# EAGLE design Attenuator (EAGLE 9.3.1)
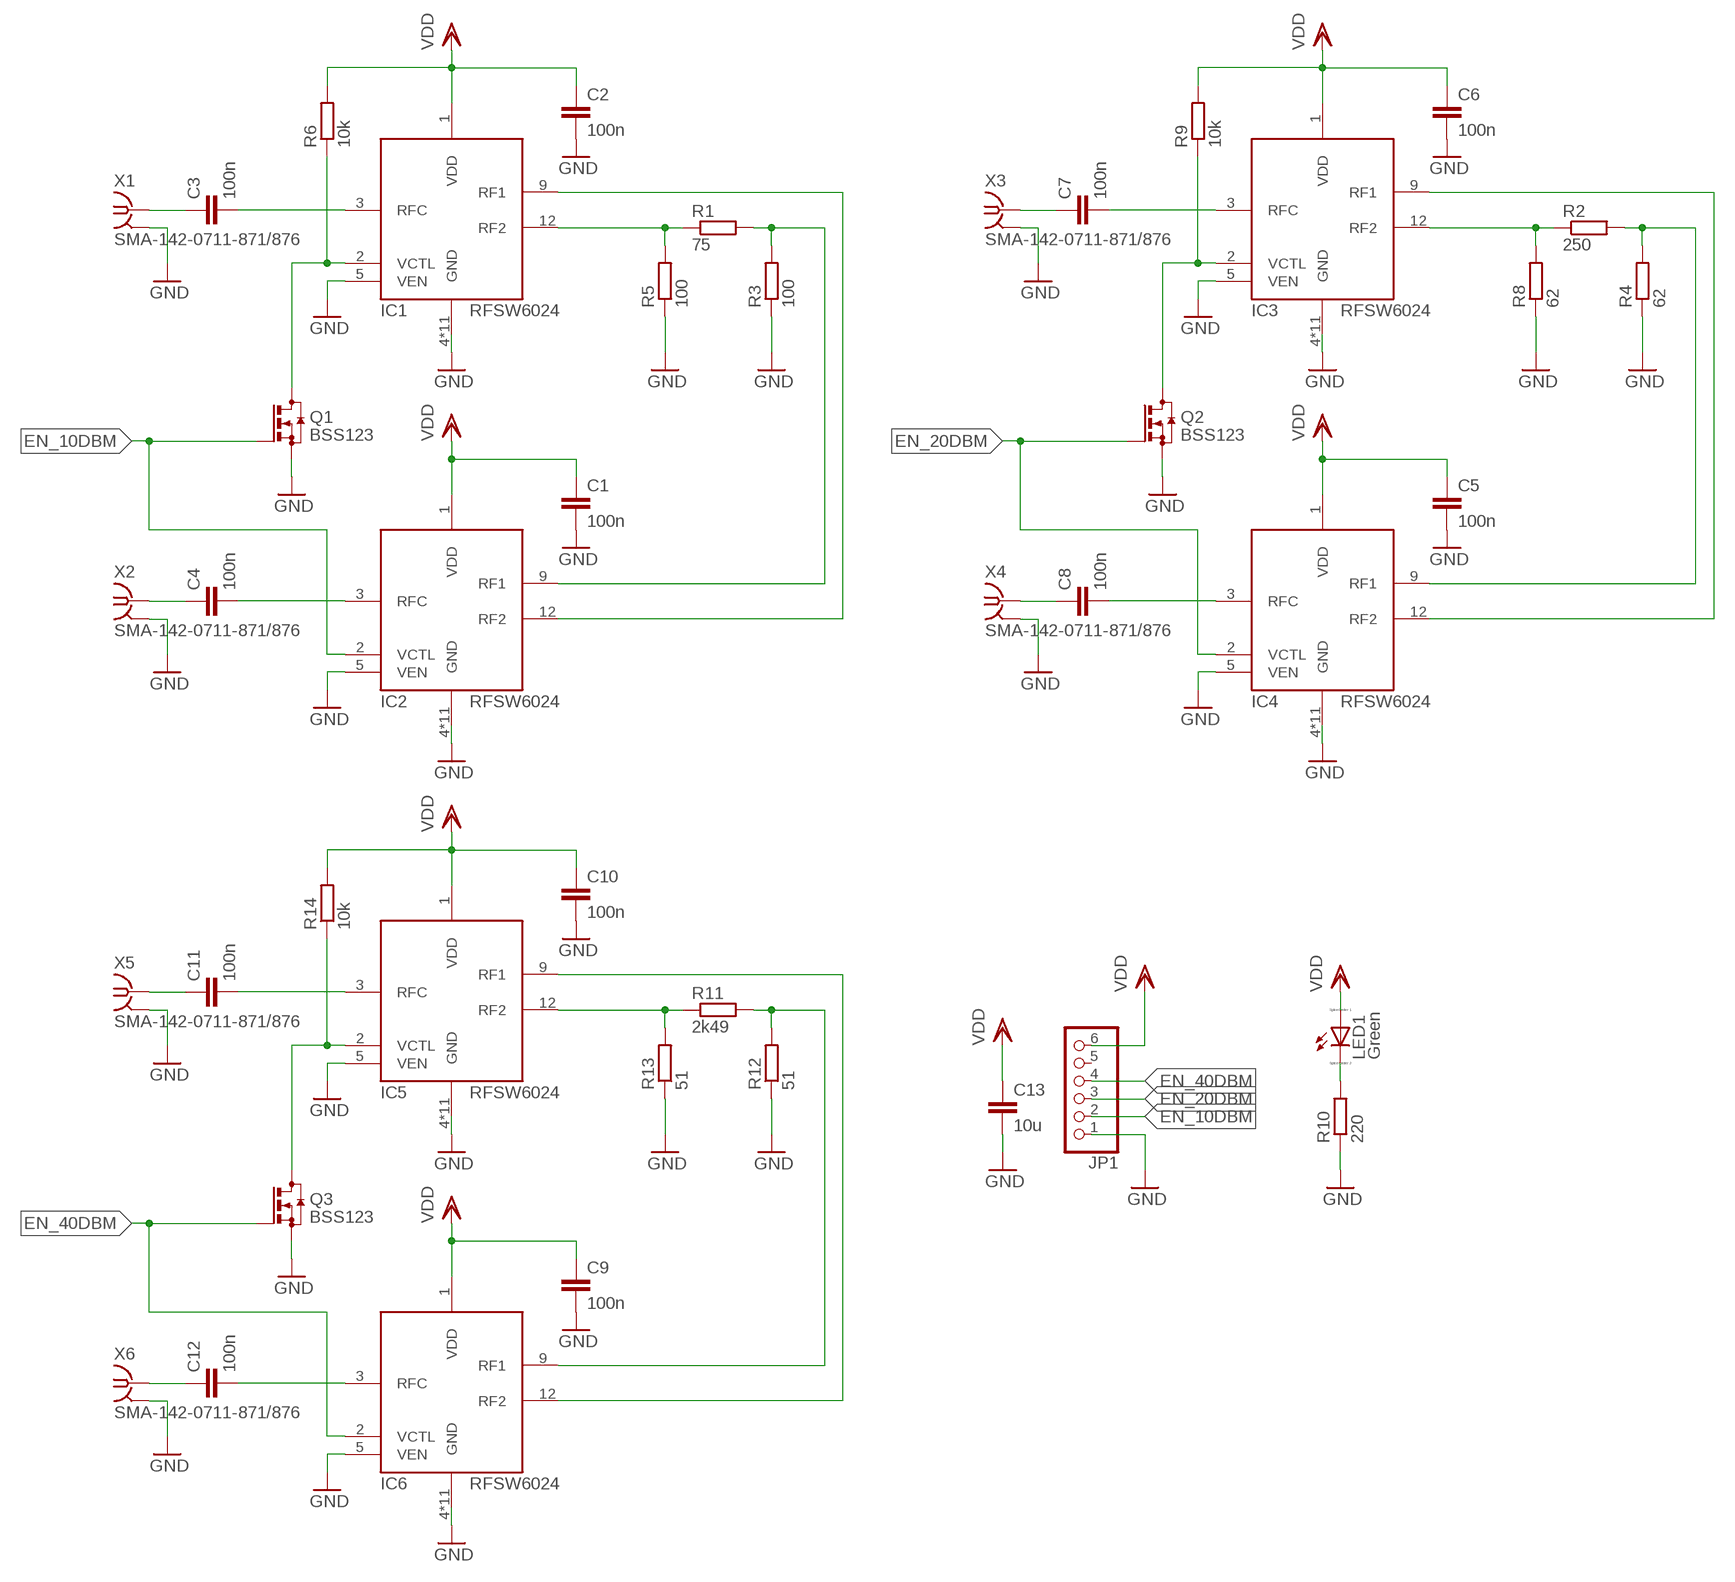
[diagram p0: schematic, sheet 1]

## Parts
C1  100n  C-EUC0603K  [C0603K]
C2  100n  C-EUC0603K  [C0603K]
C3  100n  C-EUC0603K  [C0603K]
C4  100n  C-EUC0603K  [C0603K]
C5  100n  C-EUC0603K  [C0603K]
C6  100n  C-EUC0603K  [C0603K]
C7  100n  C-EUC0603K  [C0603K]
C8  100n  C-EUC0603K  [C0603K]
C9  100n  C-EUC0603K  [C0603K]
C10  100n  C-EUC0603K  [C0603K]
C11  100n  C-EUC0603K  [C0603K]
C12  100n  C-EUC0603K  [C0603K]
C13  10u  C-EUC1206  [C1206]
IC1  RFSW6024  [QFN16]
IC2  RFSW6024  [QFN16]
IC3  RFSW6024  [QFN16]
IC4  RFSW6024  [QFN16]
IC5  RFSW6024  [QFN16]
IC6  RFSW6024  [QFN16]
JP1  PINHD-1X6/90  [1X06/90]
LED1  Green  LED_ESML0603  [LED_SML0603]
Q1  BSS123  [SOT23]
Q2  BSS123  [SOT23]
Q3  BSS123  [SOT23]
R1  75  R-EU_R0603  [R0603]
R2  250  R-EU_R0603  [R0603]
R3  100  R-EU_R0603  [R0603]
R4  62  R-EU_R0603  [R0603]
R5  100  R-EU_R0603  [R0603]
R6  10k  R-EU_R0603  [R0603]
R8  62  R-EU_R0603  [R0603]
R9  10k  R-EU_R0603  [R0603]
R10  220  R-EU_R0603  [R0603]
R11  2k49  R-EU_R0603  [R0603]
R12  51  R-EU_R0603  [R0603]
R13  51  R-EU_R0603  [R0603]
R14  10k  R-EU_R0603  [R0603]
X1  SMA-142-0711-871/876  [J502-ND-142-0711-871/876]
X2  SMA-142-0711-871/876  [J502-ND-142-0711-871/876]
X3  SMA-142-0711-871/876  [J502-ND-142-0711-871/876]
X4  SMA-142-0711-871/876  [J502-ND-142-0711-871/876]
X5  SMA-142-0711-871/876  [J502-ND-142-0711-871/876]
X6  SMA-142-0711-871/876  [J502-ND-142-0711-871/876]

## Nets
EN_10DBM: IC2.2(VCTL) JP1.2 Q1.1(G)
EN_20DBM: IC4.2(VCTL) JP1.3 Q2.1(G)
EN_40DBM: IC6.2(VCTL) JP1.4 Q3.1(G)
GND: C1.2 C2.2 C5.2 C6.2 C9.2 C10.2 C13.2 IC1.4(GND) IC1.5(VEN) IC1.6(GND) IC1.7(GND) IC1.8(GND) IC1.10(GND) IC1.11(GND) IC1.13(GND) IC1.14(GND) IC1.15(GND) IC1.16(GND) IC1.17(GND) IC2.4(GND) IC2.5(VEN) IC2.6(GND) IC2.7(GND) IC2.8(GND) IC2.10(GND) IC2.11(GND) IC2.13(GND) IC2.14(GND) IC2.15(GND) IC2.16(GND) IC2.17(GND) IC3.4(GND) IC3.5(VEN) IC3.6(GND) IC3.7(GND) IC3.8(GND) IC3.10(GND) IC3.11(GND) IC3.13(GND) IC3.14(GND) IC3.15(GND) IC3.16(GND) IC3.17(GND) IC4.4(GND) IC4.5(VEN) IC4.6(GND) IC4.7(GND) IC4.8(GND) IC4.10(GND) IC4.11(GND) IC4.13(GND) IC4.14(GND) IC4.15(GND) IC4.16(GND) IC4.17(GND) IC5.4(GND) IC5.5(VEN) IC5.6(GND) IC5.7(GND) IC5.8(GND) IC5.10(GND) IC5.11(GND) IC5.13(GND) IC5.14(GND) IC5.15(GND) IC5.16(GND) IC5.17(GND) IC6.4(GND) IC6.5(VEN) IC6.6(GND) IC6.7(GND) IC6.8(GND) IC6.10(GND) IC6.11(GND) IC6.13(GND) IC6.14(GND) IC6.15(GND) IC6.16(GND) IC6.17(GND) JP1.1 Q1.2(S) Q2.2(S) Q3.2(S) R3.1 R4.1 R5.1 R8.1 R10.1 R12.1 R13.1 X1.G@1 X1.G@2 X1.G@3 X1.G@4 X2.G@1 X2.G@2 X2.G@3 X2.G@4 X3.G@1 X3.G@2 X3.G@3 X3.G@4 X4.G@1 X4.G@2 X4.G@3 X4.G@4 X5.G@1 X5.G@2 X5.G@3 X5.G@4 X6.G@1 X6.G@2 X6.G@3 X6.G@4
N$1: IC1.9(RF1) IC2.12(RF2)
N$2: IC1.12(RF2) R1.1 R5.2
N$3: IC2.9(RF1) R1.2 R3.2
N$4: IC3.12(RF2) R2.1 R8.2
N$5: C3.2 IC1.3(RFC)
N$6: C4.2 IC2.3(RFC)
N$7: C4.1 X2.1
N$8: C3.1 X1.1
N$9: IC1.2(VCTL) Q1.3(D) R6.1
N$11: IC4.9(RF1) R2.2 R4.2
N$12: IC3.9(RF1) IC4.12(RF2)
N$13: C7.2 IC3.3(RFC)
N$14: C8.2 IC4.3(RFC)
N$15: C8.1 X4.1
N$16: C7.1 X3.1
N$17: IC3.2(VCTL) Q2.3(D) R9.1
N$19: IC5.12(RF2) R11.1 R13.2
N$20: IC6.9(RF1) R11.2 R12.2
N$21: IC5.9(RF1) IC6.12(RF2)
N$22: C11.2 IC5.3(RFC)
N$23: C12.2 IC6.3(RFC)
N$24: C12.1 X6.1
N$25: C11.1 X5.1
N$26: IC5.2(VCTL) Q3.3(D) R14.1
N$29: LED1.C R10.2
VDD: C1.1 C2.1 C5.1 C6.1 C9.1 C10.1 C13.1 IC1.1(VDD) IC2.1(VDD) IC3.1(VDD) IC4.1(VDD) IC5.1(VDD) IC6.1(VDD) JP1.6 LED1.A R6.2 R9.2 R14.2
Unconnected: JP1.5

## Library data of the parts
C1-C12 = rcl:C-EU: CAPACITOR, European symbol; SPICEPREFIX: C
C13 = rcl:C-EU: CAPACITOR, European symbol
IC1-IC6 = custom-ic:RFSW6024
JP1 = pinhead:PINHD-1X6: PIN HEADER
LED1 = eagle-ltspice:LED_E: LED Source: http://www.osram.convergy.de Source: www.luxeon.com Source: www.kingbright.com; SPICEMODEL: NONE; SPICEPREFIX: D; SPICETYPE: diode
Q1-Q3 = transistor-small-signal:BSS123: N-CHANNEL MOS FET
R1-R6 R8-R14 = resistor:R-EU_: RESISTOR, European symbol
X1-X6 = con-coax:SMA-: SMA 50 Ohm End Launch Jack Receptacle - Round Contact Johnson Components Source: www.johnsoncomponents.com .. J502-ND.pdf; MF: JOHNSON COMPONENTS; MPN: 142-0711-871; OC_FARNELL: unknown; OC_NEWARK: 01C1639

## Board
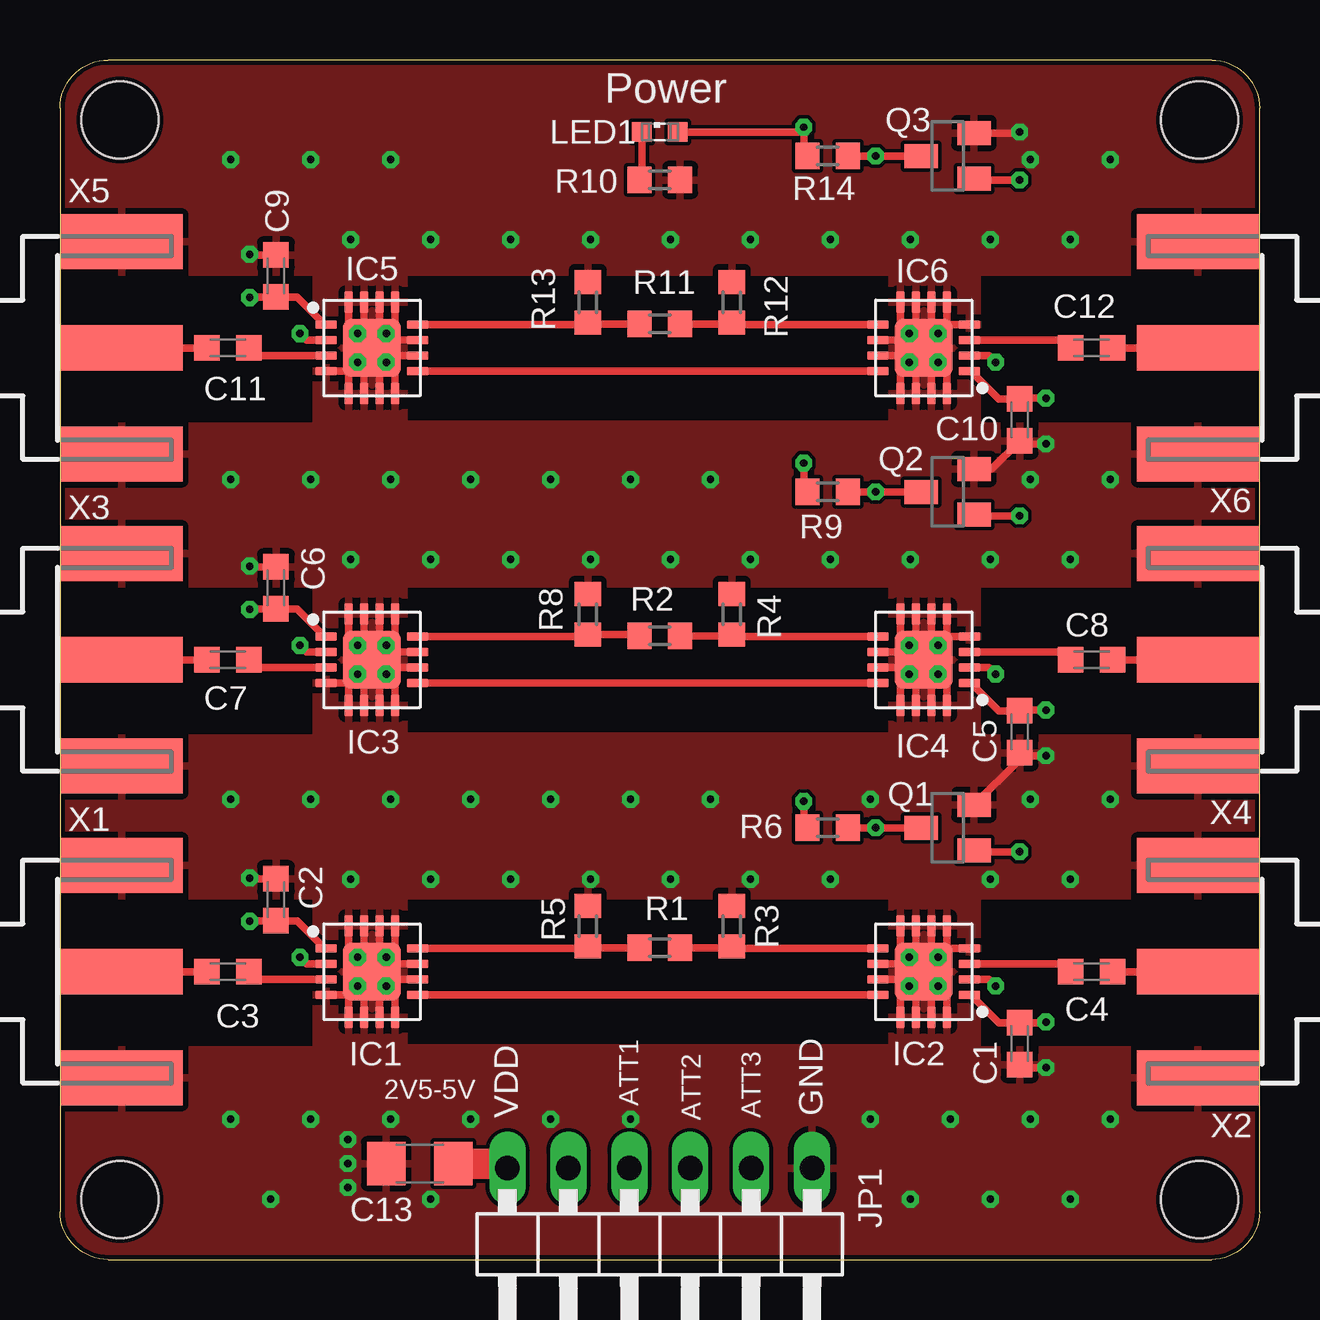
[diagram p1: board, top side]
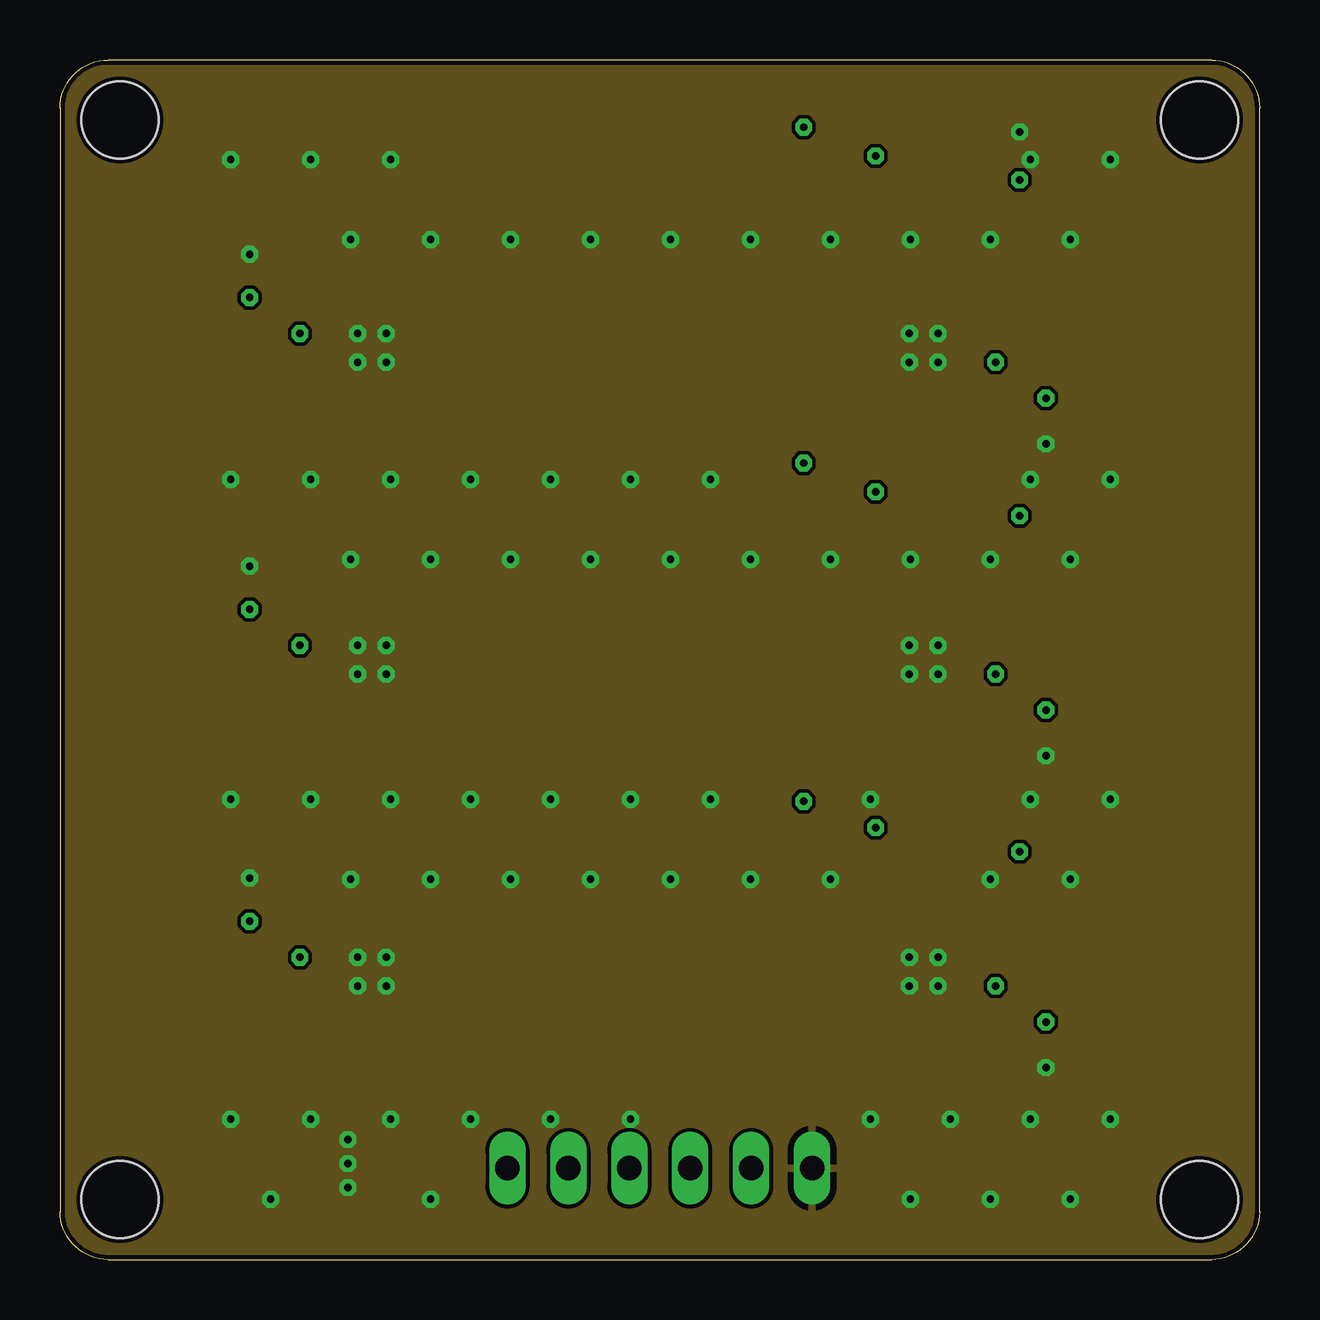
[diagram p2: board, inner layer Route2]
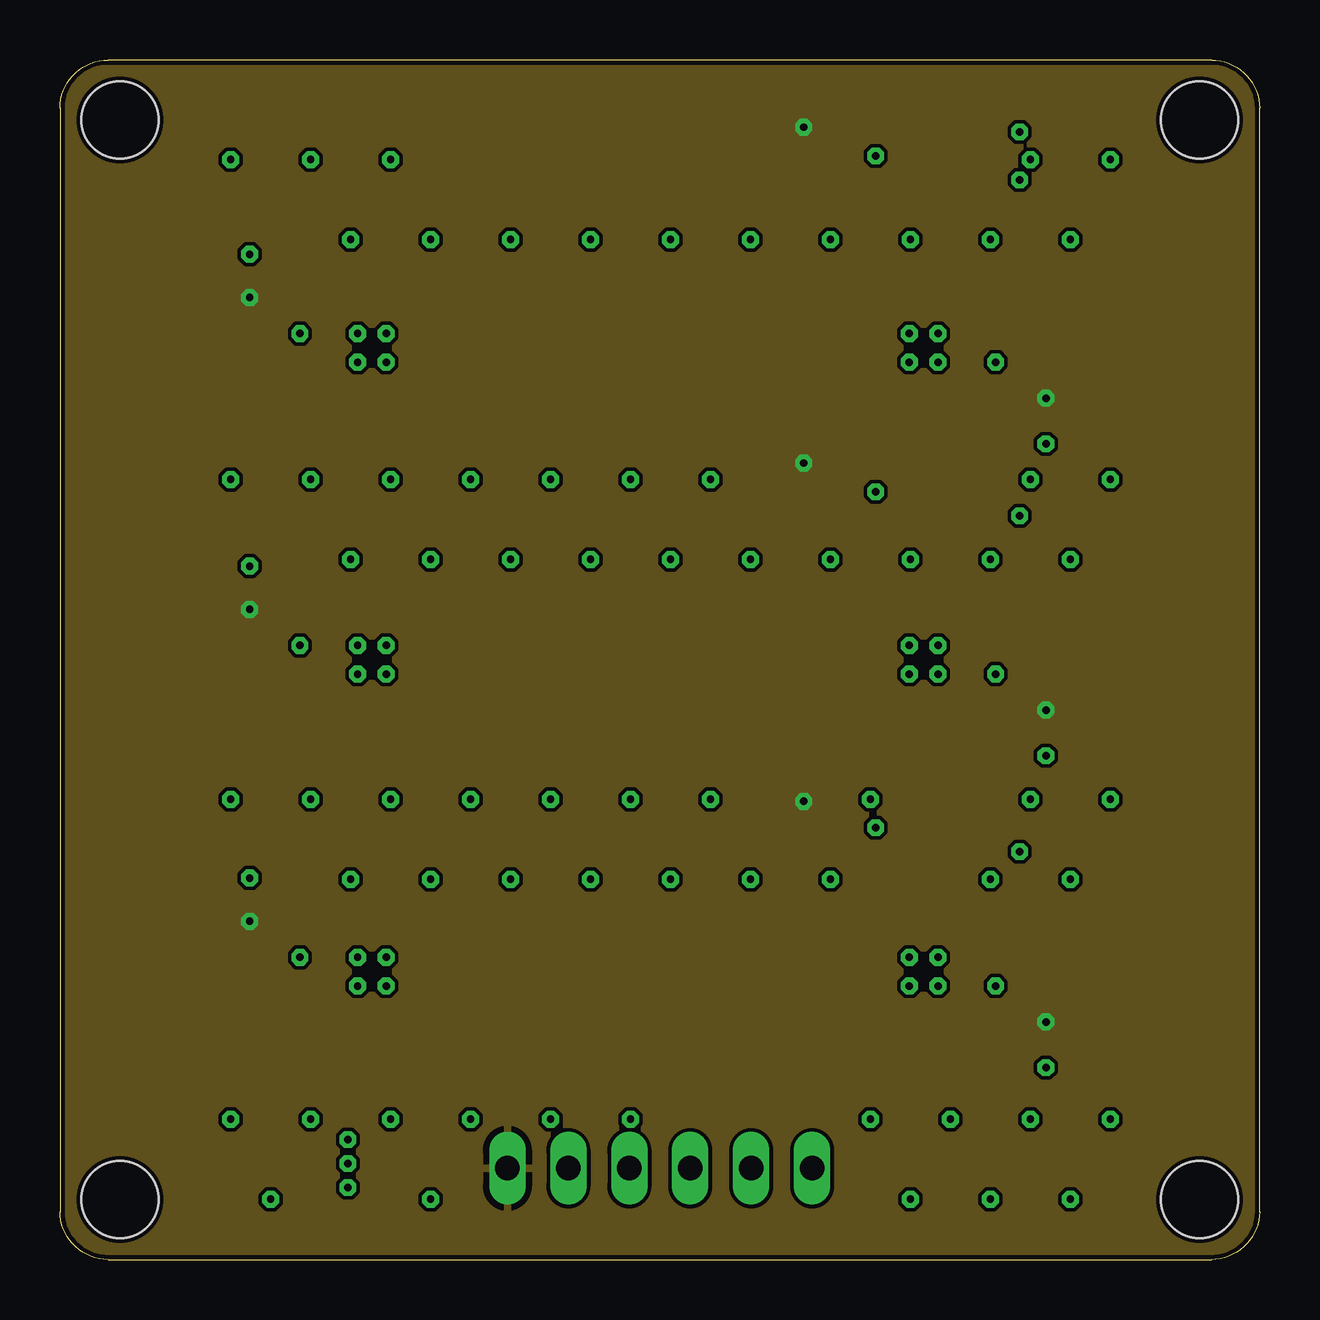
[diagram p3: board, inner layer Route15]
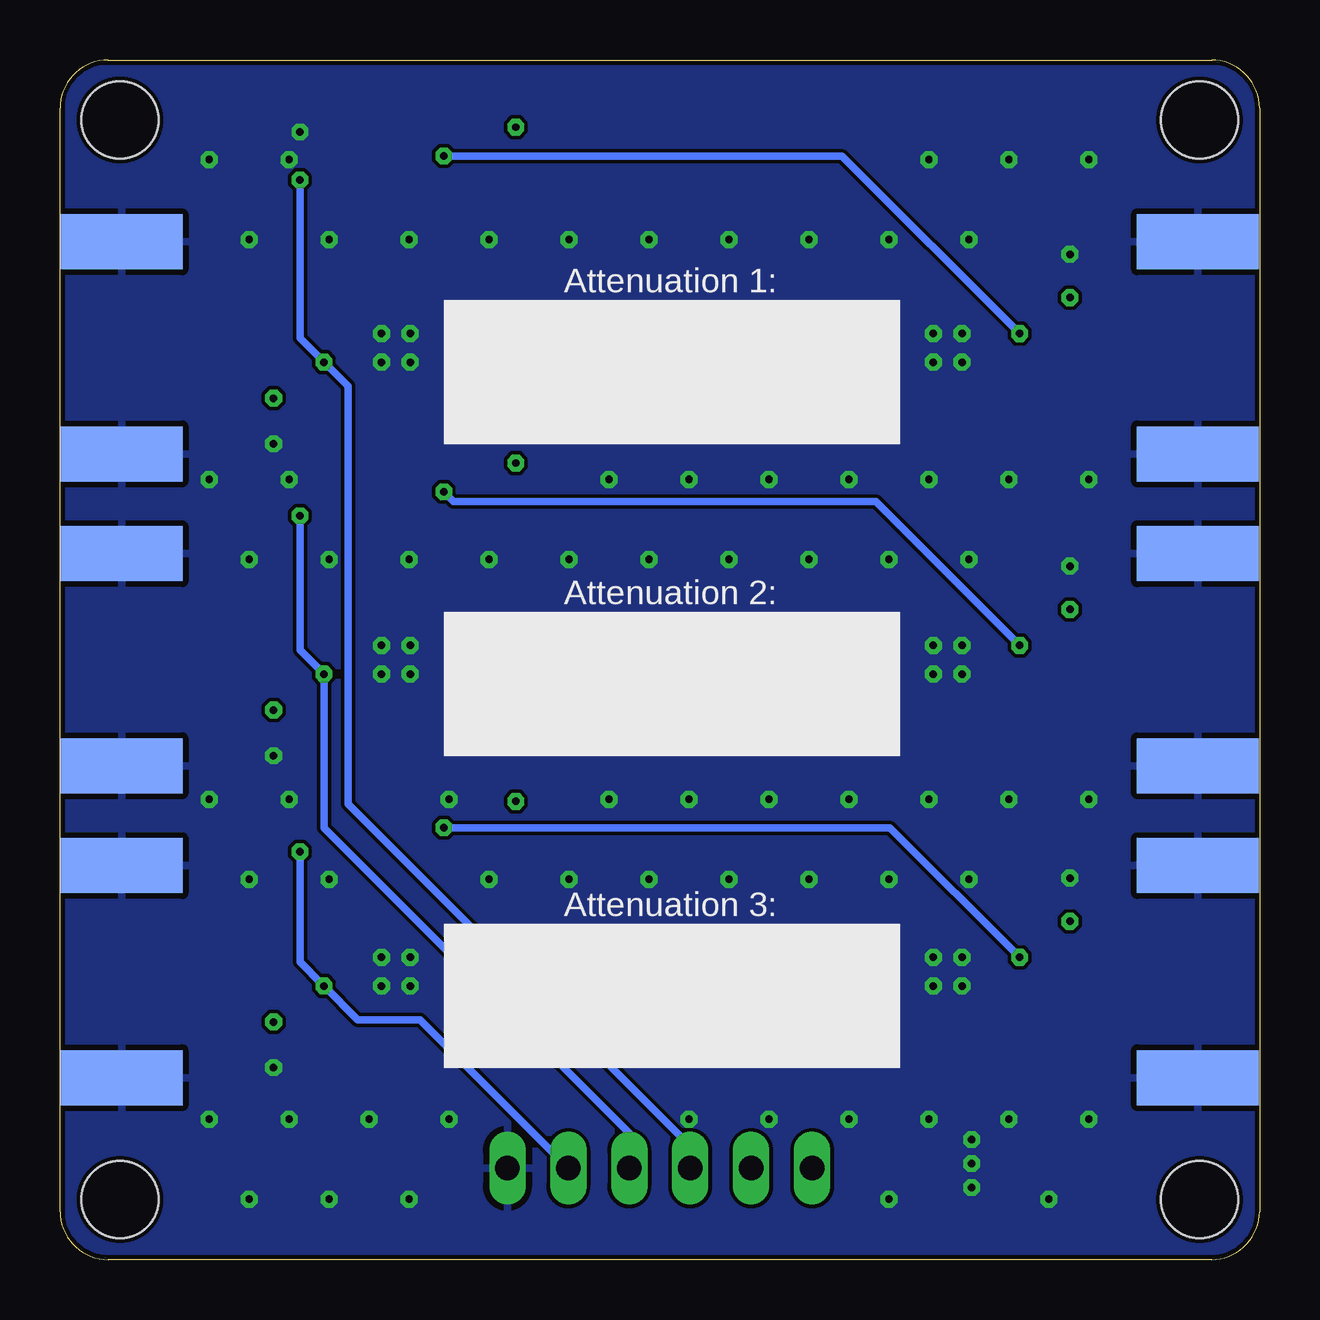
[diagram p4: board, bottom side, seen from below]

Size 50 x 50 mm. Coordinates in mm from the lower left corner, seen from the top.
Outline: 0,48 0,2 arc90 2,0 48,0 arc90 50,2 50,48 arc90 48,50 2,50 arc90 0,48
Copper layers (1+2*15+16): Top 0.035mm / dielectric 0.2mm / Route2 0.0175mm / dielectric 1.064mm / Route15 0.0175mm / dielectric 0.2mm / Bottom 0.035mm
Design rules "default *": minimum track width 6mil, minimum drill 0.3mm, track to track 6mil, track to pad 6mil, pad to pad 6mil, via to via 6mil, smd to smd 6mil, copper to edge 0.2mm, drill to drill 0.2mm, minimum pad ring 10mil, minimum via ring 8mil, stop-mask expansion 4mil, vias tented up to drill 0mil, thermal gap 10mil
Holes 3.2 mm at 2.5,47.5 47.5,47.5 47.5,2.5 2.5,2.5
tRestrict: area 14.5,22 to 34.5,28; area 38.4,21.9 to 49,28; area 1,21.9 to 10.5,28; area 38.4,8.9 to 49,15; area 14.5,35 to 34.5,41; area 38.4,34.9 to 49,41; area 1,34.9 to 10.5,41; area 14.5,9 to 34.5,15; area 1,8.9 to 10.5,15

### Footprints (pad centres in the part's own frame; a part is rotated, then mirrored left to right if it is on the bottom)
C0603K = smd 1.05 x 1.08: 1 -0.875,0; 2 0.875,0
C1206 = smd 1.6 x 1.8: 1 -1.4,0; 2 1.4,0
QFN16 = smd 0.9 x 0.35: 1 -1.9,0.975; 2 -1.9,0.325; 3 -1.9,-0.325; 4 -1.9,-0.975; 9 1.9,-0.975; 10 1.9,-0.325; 11 1.9,0.325; 12 1.9,0.975 | smd 0.35 x 0.9: 5 -0.975,-1.9; 6 -0.325,-1.9; 7 0.325,-1.9; 8 0.975,-1.9; 13 0.975,1.9; 14 0.325,1.9; 15 -0.325,1.9; 16 -0.975,1.9 | smd 2.4 x 2.4: 17 0,0
1X06/90 = drill 1.016 long: 1 -6.35,-3.81; 2 -3.81,-3.81; 3 -1.27,-3.81; 4 1.27,-3.81; 5 3.81,-3.81; 6 6.35,-3.81
LED_SML0603 = smd 0.8 x 0.8: A 0.75,0; C -0.75,0
SOT23 = smd 1 x 1.4: 1 -0.95,-1.1; 2 0.95,-1.1; 3 0,1.1
R0603 = smd 1 x 1.1: 1 -0.85,0; 2 0.85,0
J502-ND-142-0711-871/876 = smd 5.08 x 1.905: 1 2.565,0 | smd 5.08 x 2.286: G@1 2.565,4.42; G@2 2.565,-4.42 | smd 5.08 x 2.286 bottom: G@3 2.565,4.42; G@4 2.565,-4.42

### Placement (x,y rotation side)
C1  40,9 270 top
C2  9,15 90 top
C3  7,12 0 top
C4  43,12 180 top
C5  40,22 270 top
C6  9,28 90 top
C7  7,25 0 top
C8  43,25 180 top
C9  9,41 90 top
C10  40,35 270 top
C11  7,38 0 top
C12  43,38 180 top
C13  15,4 180 top
IC1  13,12 0 top
IC2  36,12 180 top
IC3  13,25 0 top
IC4  36,25 180 top
IC5  13,38 0 top
IC6  36,38 180 top
JP1  25,0 180 top
LED1  25,47 0 top
Q1  37,18 90 top
Q2  37,32 90 top
Q3  37,46 90 top
R1  25,13 0 top
R2  25,26 0 top
R3  28,13.9 270 top
R4  28,26.9 270 top
R5  22,13.9 270 top
R6  32,18 180 top
R8  22,26.9 270 top
R9  32,32 180 top
R10  25,45 180 top
R11  25,39 0 top
R12  28,39.9 270 top
R13  22,39.9 270 top
R14  32,46 180 top
X1  0,12 0 top
X2  50,12 180 top
X3  0,25 0 top
X4  50,25 180 top
X5  0,38 0 top
X6  50,38 180 top

### Tracks (layer width: path | path; a pad name or v marks a point on that pad's centre or on a via)
EN_10DBM  (via drill 0.3)
  Top 0.305: IC2.2 38.73,11.68 v39,11.4 | Q1.1 38.15,17 v40,17
  Bottom 0.305: v40,17 40,12.4 39.1,11.5 v39,11.4 37.6,10 35,10 JP1.2
EN_20DBM  (via drill 0.3)
  Top 0.305: IC4.2 38.73,24.68 v39,24.4 | Q2.1 38.15,31 v40,31
  Bottom 0.305: v40,31 40,25.4 v39,24.4 39,18 26.27,5.27 JP1.3
EN_40DBM  (via drill 0.3)
  Top 0.305: IC6.2 38.73,37.67 v39,37.4 | Q3.1 38.15,45 v40,45
  Bottom 0.305: v40,45 40,38.4 v39,37.4 38,36.4 38,19 23.73,4.73 JP1.4
GND  (via drill 0.3)
  Top 0.305: IC6.11 35.67,37.67 | 35.67,37.67 IC6.17 | IC6.10 35.67,38.33 | IC6.8 35.02,38.98 35.67,38.33 | 35.75,38.25 IC6.17 | IC6.6 36.33,38.33 | 36.33,38.33 36.3,38.3 | IC6.5 36.98,38.98 | IC6.4 36.98,38.98 | 36.98,38.98 36.33,38.33 | 36.3,38.3 36.1,38.1 | IC6.16 36.98,37.62 36.3,38.3 | IC6.15 36.33,37.88 36.1,38.1 | IC6.14 35.67,37.67 | IC6.17 36.1,38.1 | IC6.13 35.02,37.52 35.75,38.25 | IC4.8 35.02,25.98 35.67,25.32 | 36.1,25.7 36.33,25.93 IC4.6 | IC4.5 36.98,25.98 | 36.1,25.1 IC4.17 | IC4.4 36.98,25.98 | 36.98,25.98 36.1,25.1 | IC4.16 36.98,24.23 36.33,24.88 | 36.33,24.88 36.1,25.1 | IC4.15 36.33,24.88 | IC4.13 35.02,24.02 35.67,24.68 | IC4.14 35.67,24.68 | 35.67,24.68 IC4.17 | IC4.11 35.67,24.68 | IC4.10 35.67,25.32 | IC6.7 35.67,38.33 | 35.67,38.33 35.75,38.25 | IC4.7 35.67,25.32 | 35.67,25.32 IC4.17 | IC2.10 35.12,12.32 v35.4,12.6 | IC2.11 35.67,11.68 | IC2.13 35.02,11.03 35.67,11.68 | IC2.14 35.67,11.68 | 35.67,11.68 35.85,11.85 | 35.85,11.85 IC2.17 | IC2.15 36.33,12.18 | 36.33,12.18 36.25,12.25 | 36.25,12.25 36.2,12.3 | 36.2,12.3 36,12.5 | 36.33,12.18 36.98,11.53 IC2.16 | IC2.4 36.88,12.97 36.2,12.3 | IC2.5 36.98,12.82 36.33,12.18 | IC2.6 36.33,12.32 36.25,12.25 | IC2.7 35.67,12.03 35.85,11.85 | IC2.8 35.02,12.32 35.67,11.68 | IC1.4 12.03,11.03 | 12.95,11.95 IC1.17 13.32,12.32 | IC1.5 12.03,11.03 | 12.03,11.03 12.75,11.75 | 12.75,11.75 12.95,11.95 | IC1.6 12.68,11.68 12.7,11.7 | IC1.7 13.32,11.57 | 13.32,11.57 13.22,11.68 | 13.22,11.68 12.95,11.95 | IC1.8 13.97,10.93 13.32,11.57 | IC1.10 13.22,11.68 | IC1.11 13.32,12.32 | IC1.13 13.97,12.97 13.32,12.32 | IC1.14 13.32,12.32 | IC1.15 12.68,12.88 v12.4,12.6 | IC1.16 12.03,12.47 12.75,11.75 | IC3.5 12.03,25.23 v12.4,25.6 | IC3.6 12.68,24.68 12.7,24.7
  Top 0.305: 12.7,24.7 12.9,24.9 | 12.9,24.9 IC3.17 13.05,25.05 | IC3.7 13.32,24.48 | 13.32,24.48 13.15,24.65 | 13.15,24.65 12.95,24.85 | 12.95,24.85 12.9,24.9 | IC3.8 13.97,23.82 13.32,24.48 | IC3.10 13.4,24.68 | 13.4,24.68 13.18,24.68 13.15,24.65 | IC3.11 13.88,25.32 v13.6,25.6 | IC3.13 13.97,25.25 13.4,24.68 | IC3.14 13.32,25.32 13.05,25.05 | IC3.15 12.68,25.43 13.05,25.05 | IC3.16 12.03,25.38 12.7,24.7 | IC3.4 12.12,24.02 12.95,24.85 | IC5.4 12.03,37.02 | 12.85,37.85 IC5.17 | IC5.5 12.03,37.02 | 12.03,37.02 12.85,37.85 | IC5.6 12.68,37.67 12.7,37.7 | IC5.7 13.32,37.38 12.85,37.85 | IC5.8 13.97,37.02 13.32,37.67 | 13.15,37.85 IC5.17 | IC5.10 13.32,37.67 | 13.32,37.67 13.15,37.85 | IC5.11 13.62,38.33 | 13.62,38.33 13.15,37.85 | IC5.13 13.97,38.67 13.62,38.33 | IC5.14 13.32,38.33 13.05,38.05 | 13.05,38.05 IC5.17 | IC5.15 12.68,38.88 v12.4,38.6 | IC5.16 12.03,39.08 13.05,38.05 | v41.1,34 40.12,34 C10.2 38.83,32.95 Q2.2 | v41.1,21 40.12,21 C5.2 40,20.85 Q1.2 | C1.2 40.12,8 v41.1,8 | C2.2 7.92,15.88 v7.9,15.9 | C6.2 7.92,28.88 v7.9,28.9 | C9.2 7.92,41.88 v7.9,41.9 | Q3.2 39.95,46.95 v40,47
  other vias: 13.6,38.6 13.6,37.4 12.4,37.4 13.6,24.4 12.4,24.4 13.6,12.6 13.6,11.4 12.4,11.4 35.4,11.4 36.6,12.6 36.6,11.4 36.6,25.6 36.6,24.4 35.4,24.4 35.4,25.6 35.4,37.4 35.4,38.6 36.6,38.6 36.6,37.4 12,4 12,5 12,3 8.78,2.52 7.11,5.85 7.11,19.19 7.11,32.52 7.11,45.85 10.44,5.85 12.11,15.85 10.44,19.19 12.11,29.19 10.44,32.52 12.11,42.52 10.44,45.85 15.44,2.52 13.78,5.85 15.44,15.85 13.78,19.19 15.44,29.19 13.78,32.52 15.44,42.52 13.78,45.85 17.11,5.85 18.78,15.85 17.11,19.19 18.78,29.19 17.11,32.52 18.78,42.52 20.44,5.85 22.11,15.85 20.44,19.19 22.11,29.19 20.44,32.52 22.11,42.52 23.78,5.85 25.44,15.85 23.78,19.19 25.44,29.19 23.78,32.52 25.44,42.52 28.78,15.85 27.11,19.19 28.78,29.19 27.11,32.52 28.78,42.52 32.11,15.85 32.11,29.19 32.11,42.52 35.44,2.52 33.78,5.85 33.78,19.19 35.44,29.19 35.44,42.52 38.78,2.52 37.11,5.85 38.78,15.85 38.78,29.19 38.78,42.52 42.11,2.52 40.44,5.85 42.11,15.85 40.44,19.19 42.11,29.19 40.44,32.52 42.11,42.52 40.44,45.85 43.78,5.85 43.78,19.19 43.78,32.52 43.78,45.85
  pour Route2: -1.1,50.8 52.5,50.8 52.5,-1.7 -1.1,-1.7
  pour Top: -1.2,52.2 52,52.2 52,-2.4 -1.2,-2.4
  pour Bottom: -4.7,55.5 54.8,55.5 54.8,-2.2 -4.7,-2.2
N$1
  Top 0.305: IC1.9 IC2.12
N$2
  Top 0.305: R1.1 22.3,13 | 22.3,13 22.05,13 R5.2 | IC1.12 22.27,12.97 22.3,13
N$3
  Top 0.305: IC2.9 28.07,12.97 28.05,13 | 28.05,13 R3.2 | R1.2 28.05,13
N$4
  Top 0.305: R2.1 24.1,26.05 22.5,26.05 | 22.5,26.05 R8.2 | IC3.12 22.43,25.98 22.5,26.05
N$5
  Top 0.305: IC1.3 8.2,11.68 C3.2
N$6
  Top 0.305: IC2.3 41.8,12.32 C4.2
N$7
  Top 0.305: X2.1 C4.1
N$8
  Top 0.305: X1.1 C3.1
N$9  (via drill 0.3)
  Top 0.305: IC1.2 10.28,12.32 v10,12.6 | Q1.3 v34,18 R6.1
  Bottom 0.305: v34,18 15.4,18 v10,12.6
N$11
  Top 0.305: IC4.9 28.07,25.98 28.05,26 | 28.05,26 R4.2 | R2.2 28.05,26
N$12
  Top 0.305: IC3.9 IC4.12
N$13
  Top 0.305: IC3.3 8.2,24.68 C7.2
N$14
  Top 0.305: IC4.3 41.8,25.32 C8.2
N$15
  Top 0.305: C8.1 X4.1
N$16
  Top 0.305: C7.1 X3.1
N$17  (via drill 0.3)
  Top 0.305: IC3.2 10.28,25.32 v10,25.6 | Q2.3 v34,32 R9.1
  Bottom 0.305: v34,32 33.6,31.6 16,31.6 v10,25.6
N$19
  Top 0.305: IC5.12 21.93,38.98 R13.2 22.05,39 R11.1
N$20
  Top 0.305: IC6.9 28.07,38.98 R12.2 27.95,39 R11.2
N$21
  Top 0.305: IC5.9 IC6.12
N$22
  Top 0.305: IC5.3 8.2,37.67 C11.2
N$23
  Top 0.305: IC6.3 41.8,38.33 C12.2
N$24
  Top 0.305: X6.1 C12.1
N$25
  Top 0.305: X5.1 C11.1
N$26  (via drill 0.3)
  Top 0.305: IC5.2 10.28,38.33 v10,38.6 | Q3.3 v34,46 R14.1
  Bottom 0.305: v34,46 17.4,46 v10,38.6
N$29
  Top 0.305: LED1.C 24.25,45 R10.2
VDD  (via drill 0.3)
  Top 0.305: IC1.1 11.03,12.97 9.88,14.12 C2.1 7.92,14.12 v7.9,14.1 | IC3.1 11.03,25.98 9.88,27.12 C6.1 7.92,27.12 v7.9,27.1 | IC5.1 11.03,38.98 9.88,40.12 C9.1 7.92,40.12 v7.9,40.1 | IC6.1 37.98,37.02 39.12,35.88 C10.1 40.02,35.9 v41.1,35.9 | IC4.1 37.98,24.02 39.12,22.88 C5.1 40.02,22.9 v41.1,22.9 | IC2.1 37.98,11.03 39.12,9.88 C1.1 41.08,9.88 v41.1,9.9 | R14.2 31,46.15 v31,47.2 30.8,47 LED1.A | R9.2 31,32.15 v31,33.2 | R6.2 31,18.15 v31,19.1
  Top 1.27: C13.1 18.46,4 JP1.6
  pour Route15: -1.3,50.9 51.2,50.9 51.2,-1.2 -1.3,-1.2

### Text on the board
tPlace: Power | 2V5-5V | VDD | ATT1 | ATT2 | ATT3 | GND
bPlace: Attenuation 1: | Attenuation 2: | Attenuation 3: